# Altium schematic sheet JS7628_base_PWM_LED_IR_KEY_v1.0.SchDoc
size A4
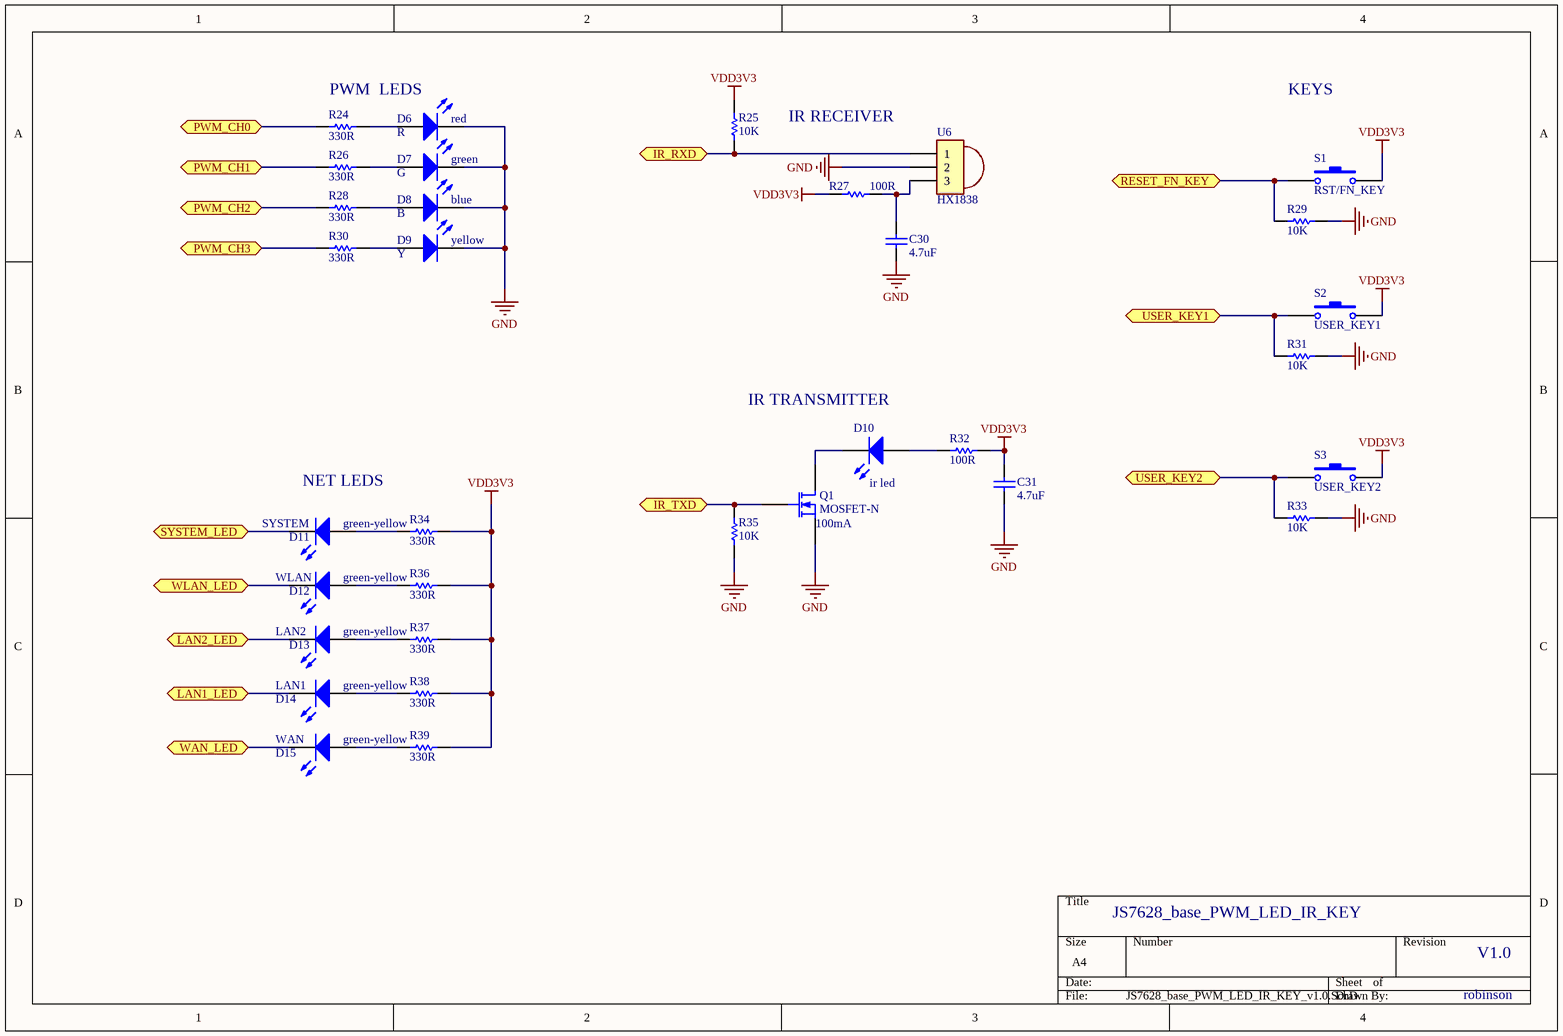
[diagram p0: JS7628_base_PWM_LED_IR_KEY_v1.0.SchDoc]

## Parts
C30  value 4.7uF  [0603]  (hidden comment: CAP-SMT)
C31  value 4.7uF  [0603]  (hidden comment: CAP-SMT)
D6  R  value red  [0805-LED]
D7  G  value green  [0805-LED]
D8  B  value blue  [0805-LED]
D9  Y  value yellow  [0805-LED]
D10  value ir led  [LED-5mm-90d]  (hidden comment: LED)
D11  SYSTEM  value green-yellow  [0805-LED]
D12  WLAN  value green-yellow  [0805-LED]
D13  LAN2  value green-yellow  [0805-LED]
D14  LAN1  value green-yellow  [0805-LED]
D15  WAN  value green-yellow  [0805-LED]
Q1  MOSFET-N  value 100mA  [SOT23-3P]
R24  value 330R  [0603]  (hidden comment: RES-SMT)
R25  value 10K  [0603]  (hidden comment: RES-SMT)
R26  value 330R  [0603]  (hidden comment: RES-SMT)
R27  value 100R  [0603]  (hidden comment: RES-SMT)
R28  value 330R  [0603]  (hidden comment: RES-SMT)
R29  value 10K  [0603]  (hidden comment: RES-SMT)
R30  value 330R  [0603]  (hidden comment: RES-SMT)
R31  value 10K  [0603]  (hidden comment: RES-SMT)
R32  value 100R  [0603]  (hidden comment: RES-SMT)
R33  value 10K  [0603]  (hidden comment: RES-SMT)
R34  value 330R  [0603]  (hidden comment: RES-SMT)
R35  value 10K  [0603]  (hidden comment: RES-SMT)
R36  value 330R  [0603]  (hidden comment: RES-SMT)
R37  value 330R  [0603]  (hidden comment: RES-SMT)
R38  value 330R  [0603]  (hidden comment: RES-SMT)
R39  value 330R  [0603]  (hidden comment: RES-SMT)
S1  RST/FN_KEY  [SW-2P]
S2  USER_KEY1  [SW-2P]
S3  USER_KEY2  [SW-2P]
U6  HX1838  [HX1838]

## Ports
IR_RXD, IR_TXD, LAN1_LED, LAN2_LED, PWM_CH0, PWM_CH1, PWM_CH2, PWM_CH3, RESET_FN_KEY, SYSTEM_LED, USER_KEY1, USER_KEY2, WAN_LED, WLAN_LED

## Nets
GND: C30.1 C31.1 D6.2(K) D7.2(K) D8.2(K) D9.2(K) Q1.2(S) R29.2 R31.2 R33.2 R35.1 U6.2
VDD3V3: C31.2 R25.2 R27.1 R32.1 R34.2 R36.2 R37.2 R38.2 R39.2 S1.2 S2.2 S3.2
IR_RXD: R25.1 U6.1 ; port IR_RXD
IR_TXD: Q1.1(G) R35.2 ; port IR_TXD
LAN1_LED: D14.2(K) ; port LAN1_LED
LAN2_LED: D13.2(K) ; port LAN2_LED
PWM_CH0: R24.1 ; port PWM_CH0
PWM_CH1: R26.1 ; port PWM_CH1
PWM_CH2: R28.1 ; port PWM_CH2
PWM_CH3: R30.1 ; port PWM_CH3
RESET_FN_KEY: R29.1 S1.1 ; port RESET_FN_KEY
SYSTEM_LED: D11.2(K) ; port SYSTEM_LED
USER_KEY1: R31.1 S2.1 ; port USER_KEY1
USER_KEY2: R33.1 S3.1 ; port USER_KEY2
WAN_LED: D15.2(K) ; port WAN_LED
WLAN_LED: D12.2(K) ; port WLAN_LED
NetC30_2: C30.2 R27.2 U6.3
NetD6_1: D6.1(A) R24.2
NetD7_1: D7.1(A) R26.2
NetD8_1: D8.1(A) R28.2
NetD9_1: D9.1(A) R30.2
NetD10_1: D10.1(A) R32.2
NetD10_2: D10.2(K) Q1.3(D)
NetD11_1: D11.1(A) R34.1
NetD12_1: D12.1(A) R36.1
NetD13_1: D13.1(A) R37.1
NetD14_1: D14.1(A) R38.1
NetD15_1: D15.1(A) R39.1

## Notes on the sheet
- PWM  LEDS
- KEYS
- IR RECEIVER
- (near D10) IR TRANSMITTER
- NET LEDS
- JS7628_base_PWM_LED_IR_KEY
- V1.0
- robinson

## Library data of the parts
D6-D9 D11-D15 = LED
Q1 = MOSFET-N: N-Channel MOSFET; Part number: AO3400; Published: 8-Jun-2000; LatestRevisionDate: 17-Jul-2002; LatestRevisionNote: Re-released for DXP Platform.; PackageVersion: 1995/1996; PackageReference: E3; Publisher: Altium Limited
S1-S3 = SW-2P